# EAGLE schematic basestation (EAGLE 7.3.0)
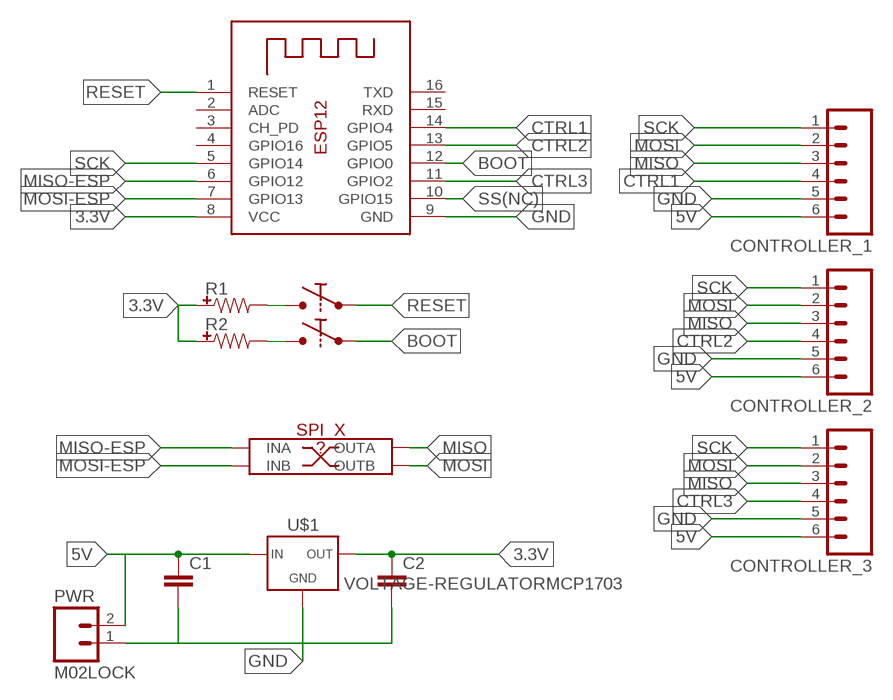
[diagram p0: schematic, sheet 1]

## Parts
BOOT  BUTTONPJRC  [BUTTON-PJRC]
C1  CAPUNIVERSAL  [0402-0603-0805-UNIVERSAL]
C2  CAPUNIVERSAL  [0402-0603-0805-UNIVERSAL]
CONTROLLER_1  M06LOCK  [1X06_LOCK]
CONTROLLER_2  M06LOCK  [1X06_LOCK]
CONTROLLER_3  M06LOCK  [1X06_LOCK]
PWR  M02LOCK  [1X02_LOCK]
R1  RESISTORUNIVERSAL  [0402-0603-0805-UNIVERSAL]
R2  RESISTORUNIVERSAL  [0402-0603-0805-UNIVERSAL]
RESET  BUTTONPJRC  [BUTTON-PJRC]
SPI_X  UART_SWITCHER0603  [UART_SWITCHER_0603]
U$1  VOLTAGE-REGULATORMCP1703  [SOT23]
X1  ESP-12  [ESP-12]

## Nets
3.3V: C2.- R1.- R2.- U$1.2(OUT) X1.8(VCC)
5V: C1.- CONTROLLER_1.6 CONTROLLER_2.6 CONTROLLER_3.6 PWR.2 U$1.3(IN)
BOOT: BOOT.B1 BOOT.B2 X1.12(GPIO0)
CTRL1: CONTROLLER_1.4 X1.14(GPIO4)
CTRL2: CONTROLLER_2.4 X1.13(GPIO5)
CTRL3: CONTROLLER_3.4 X1.11(GPIO2)
GND: C1.+ C2.+ CONTROLLER_1.5 CONTROLLER_2.5 CONTROLLER_3.5 PWR.1 U$1.1(GND) X1.9(GND)
MISO: CONTROLLER_1.3 CONTROLLER_2.3 CONTROLLER_3.3 SPI_X.RX_B(OUTA)
MISO-ESP: SPI_X.TX_A(INA) X1.6(GPIO12)
MOSI: CONTROLLER_1.2 CONTROLLER_2.2 CONTROLLER_3.2 SPI_X.TX_B(OUTB)
MOSI-ESP: SPI_X.RX_A(INB) X1.7(GPIO13)
N$3: R1.+ RESET.A1 RESET.A2
N$4: BOOT.A1 BOOT.A2 R2.+
RESET: RESET.B1 RESET.B2 X1.1(RESET)
SCK: CONTROLLER_1.1 CONTROLLER_2.1 CONTROLLER_3.1 X1.5(GPIO14)
SS(NC): X1.10(GPIO15)
Unconnected: X1.2(ADC) X1.3(CH_PD) X1.4(GPIO16) X1.15(RXD) X1.16(TXD)

## Library data of the parts
BOOT RESET = tekdemo:BUTTON
C1 C2 = tekdemo:CAP: Capacitor Standard 0603 ceramic capacitor, and 0.1" leaded capacitor.
CONTROLLER_1-CONTROLLER_3 = tekdemo:M06: Header 6 Standard 6-pin 0.1" header. Use with straight break away headers (SKU : PRT-00116), right angle break away headers (PRT-00553), swiss pins (PRT-00743), machine pins (PRT-00117), and female headers (PRT-00115). Molex polarized connector foot print use with SKU : PRT-08094 with associated crimp pins and housings. NOTES ON THE VARIANTS LOCK and LOCK_LONGPADS... This footprint was designed to help hold the alignment of a through-hole component (i.e. 6-pin header) while soldering it into place. You may notice that each hole has been shifted either up or down by 0.005 of an inch from it's more standard position (which is a perfectly straight line). This slight alteration caused the pins (the squares in the middle) to touch the edges of the holes. Because they are alternating, it causes a "brace" to hold the component in place. 0.005 has proven to be the perfect amount of "off-center" position when using our standard breakaway headers. Although looks a little odd when you look at the bare footprint, once you have a header in there, the alteration is very hard to notice. Also,if you push a header all the way into place, it is covered up entirely on the bottom side. This idea of altering the position of holes to aid alignment will be further integrated into the Sparkfun Library for other footprints. It can help hold any component with 3 or more connection pins.
PWR = tekdemo:M02: Standard 2-pin 0.1" header. Use with - straight break away headers ( PRT-00116) - right angle break away headers (PRT-00553) - swiss pins (PRT-00743) - machine pins (PRT-00117) - female headers (PRT-00115) Molex polarized connector foot print use with: PRT-08233 with associated crimp pins and housings. 2.54_SCREWTERM for use with PRT-10571. 3.5mm Screw Terminal footprints for PRT-08084 5mm Screw Terminal footprints for use with PRT-08432
R1 R2 = tekdemo:RESISTOR: Resistor Basic schematic elements and footprints for 0603, 1206, and PTH resistors.
SPI_X = tekdemo:UART_SWITCHER
U$1 = tekdemo:VOLTAGE-REGULATOR
X1 = adafruit:ESP-12